# Altium schematic sheet FiveStagePipenlineCPU.SchDoc
size 347 x 254 mm
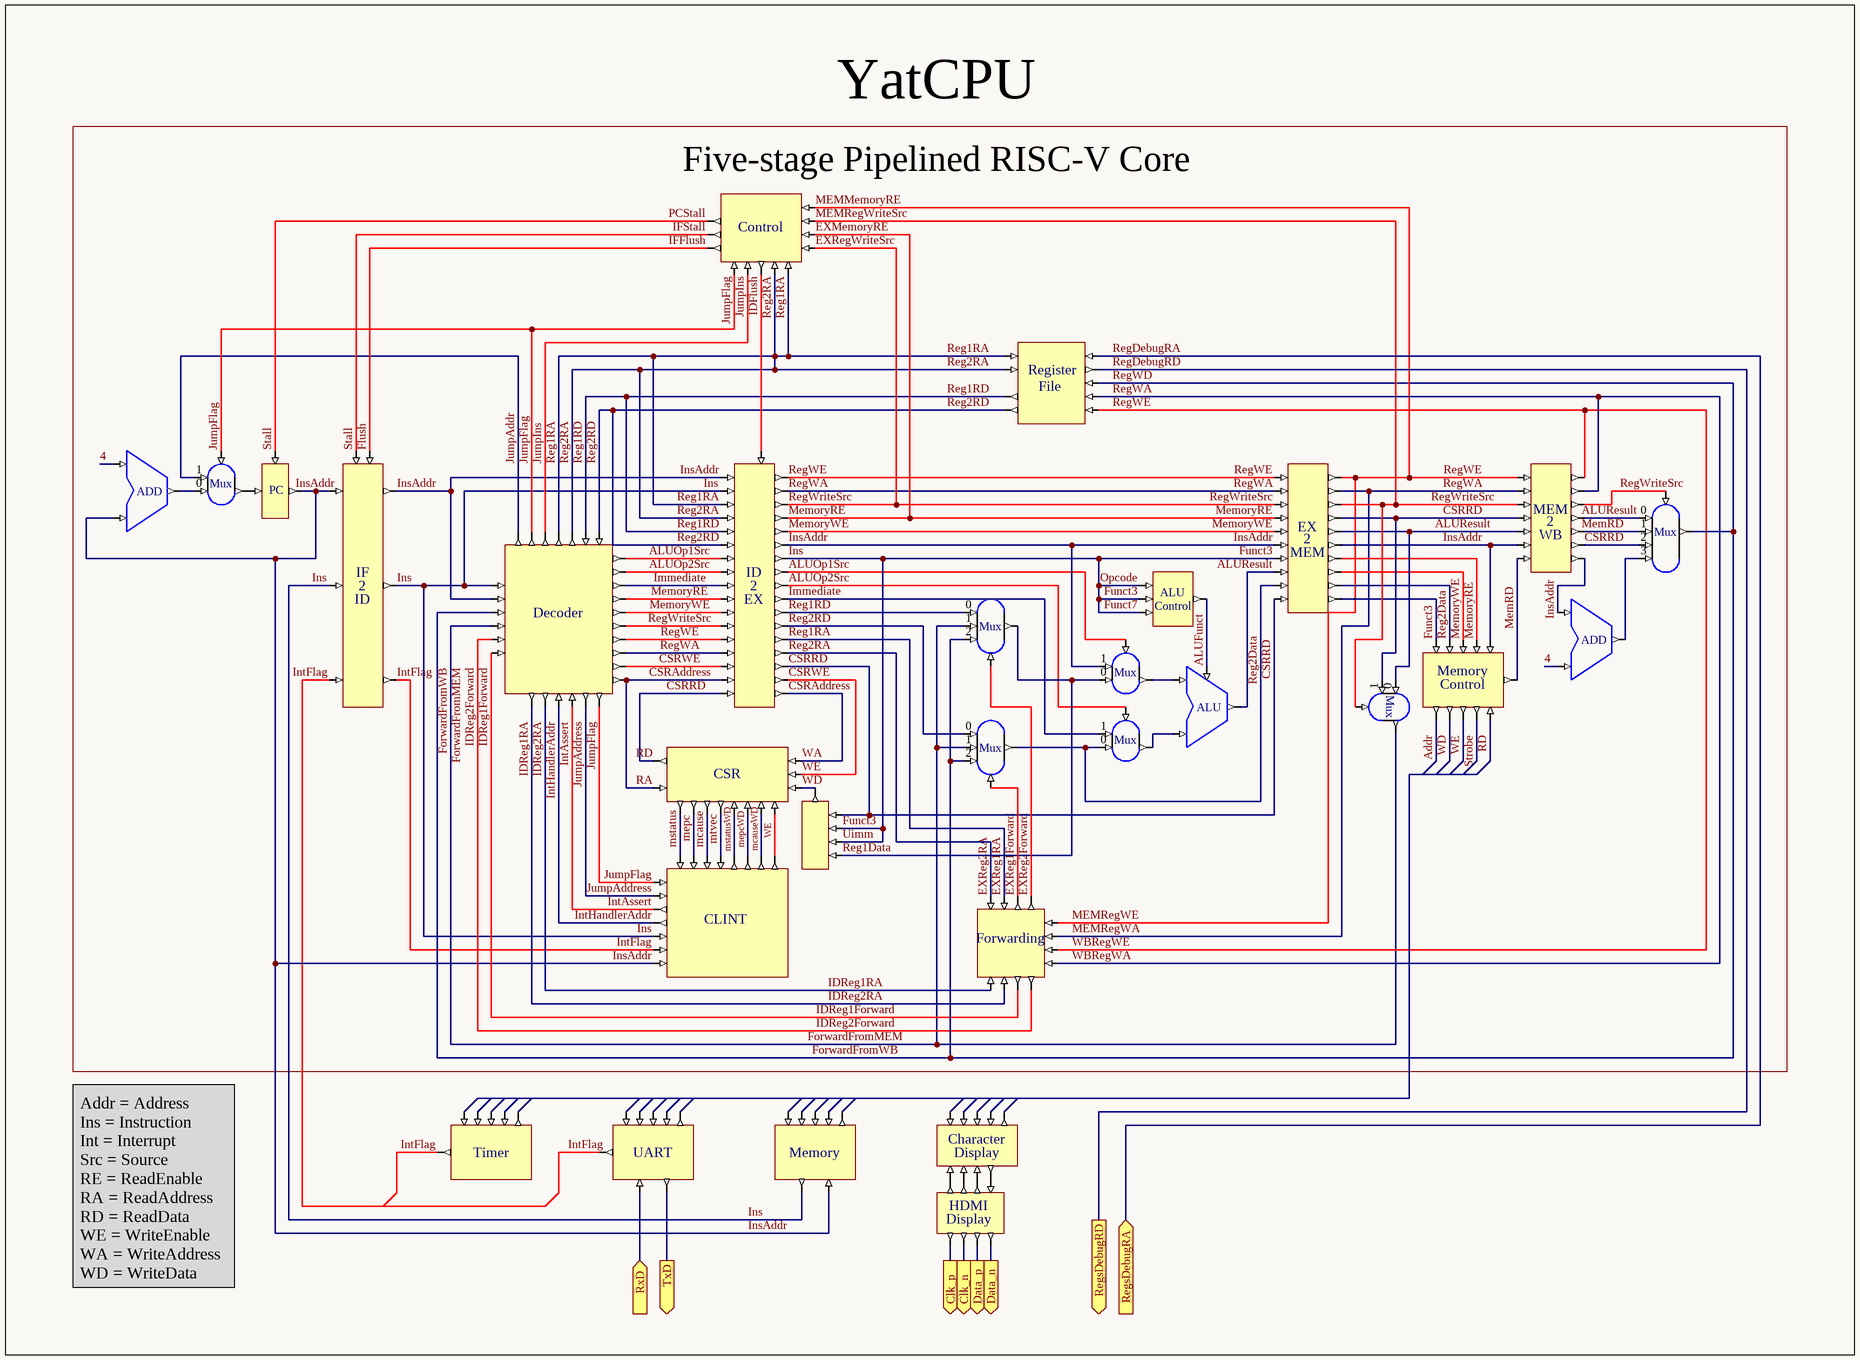
[diagram p0: FiveStagePipenlineCPU.SchDoc]

## Parts
(Parts that share a designator on the sheet are numbered #1, #2 ... from top to bottom, then left to right.)
*#1  Control  (value not drawn)
*#2  PipelineReg16  (value not drawn)
*#3  PC
*#4  PipelineReg7  (value not drawn)
*#5  ID_1  (value not drawn)
*#6  ALUControl  (value not drawn)
*#7  Mux3_1  (value not drawn)
*#8  MemoryControl_1  (value not drawn)
*#9  ALU  (value not drawn)
*#10  Mux2‘  (value not drawn)
*#11  Mux3_1  (value not drawn)
*#12  Mux2  (value not drawn)
*#13  CSRCompute_1  (value not drawn)
*#14  CLINT_1  (value not drawn)
*#15  Forwarding  (value not drawn)
*?#1  RegFile  (value not drawn)
*?#2  ADD  (value not drawn)
*?#3  Mux2  (value not drawn)
*?#4  Mux4  (value not drawn)
*?#5  ADD  (value not drawn)
*?#6  Mux2  (value not drawn)
*?#7  CSR  (value not drawn)
*?#8  Timer  (value not drawn)
*?#9  UART  (value not drawn)
*?#10  Memory  (value not drawn)
*?#11  CharacterDisplay  (value not drawn)
*?#12  HDMIDisplay  (value not drawn)
EX/MEM  PipelineReg10  (value not drawn)
IF/ID  PipelineReg3  (value not drawn)

## Blocks framed on the sheet
YatCPU: *#1-*#15 *?#1-*?#7 EX/MEM IF/ID

## Ports
Clk_n (out), Clk_p (out), Data_n (out), Data_p (out), RegsDebugRA (in), RegsDebugRD (out), RxD (in), TxD (out)

## Nets
4: *?#2.0(in0) *?#5.1(in1)
Addr: *#8.10
ALUFunct: *#6.41 *#9.3
ALUOp1Src: *#2.18 *#2.27 *#5.22 *?#6.3(select)
ALUOp2Src: *#2.7 *#2.28 *#5.14 *#12.3(select)
ALUResult: *#4.15 *#4.26 *#9.2(out) *#10.0(in0) *?#4.0(in0) EX/MEM.3(in) EX/MEM.16
Clk_n: *?#12.47 ; port Clk_n
Clk_p: *?#12.46 ; port Clk_p
CSRAddress: *#2.5(in) *#2.36 *#5.23 *?#7.22 *?#7.28  [also labelled WA]
CSRRD: *#2.6 *#2.38 *#4.17 *#4.25 *#10.1(in1) *#13.37 *?#4.2(in1) *?#7.27 EX/MEM.15 EX/MEM.30
CSRWE: *#2.8 *#2.34 *#5.21 *#8.12 *#14.21 *?#7.23 *?#7.35  [also labelled WE]
Data_n: *?#12.45 ; port Data_n
Data_p: *?#12.48 ; port Data_p
EXMemoryRE: *#1.56 *#2.14 *#2.29 *#5.16 *#8.5 EX/MEM.18 EX/MEM.25  [also labelled MemoryRE]
EXReg1Forward: *#11.4(select) *#15.42
EXReg1RA: *#1.61 *#1.62 *#2.11 *#2.22 *#2.23 *#2.24 *#5.13 *#5.35 *#15.44 *#15.45 *?#1.28 *?#1.29  [also labelled EXReg2RA, Reg1RA, Reg2RA]
EXReg2Forward: *#7.4(select) *#15.43
EXRegWriteSrc: *#1.54 *#1.57 *#2.13 *#2.31 *#4.14 *#4.24 *#5.18 *#10.3(select) *?#4.5(select) EX/MEM.14 EX/MEM.24  [also labelled MEMRegWriteSrc, RegWriteSrc]
Flush: *#1.52 IF/ID.10  [also labelled IFFlush]
ForwardFromMEM: *#5.11 *#5.27 *#7.1(in1) *#7.2(in2) *#10.2(out) *#11.1(in1) *#11.2(in2) *?#1.32 *?#4.4(out)  [also labelled ForwardFromWB, RegWD]
Funct3: *#2.2(in) *#2.17 *#5.25 *#6.38 *#6.39 *#6.40 *#8.8 *#13.36 *#13.38 *#14.25 *?#10.45 EX/MEM.20 EX/MEM.28 IF/ID.3(in) IF/ID.7  [also labelled Funct7, Ins, Opcode, Uimm]
IDFlush: *#1.60 *#2.10(FlushEnable)
IDReg1Forward: *#5.29 *#15.48
IDReg1RA: *#5.39 *#5.40 *#15.46 *#15.47  [also labelled IDReg2RA]
IDReg2Forward: *#5.28 *#15.49
IFStall: *#1.50 *#1.51 *#3.2(EN) IF/ID.9(WriteEnable)  [also labelled PCStall, Stall]
Immediate: *#2.3(in) *#2.19 *#5.15 *#12.1(in1)
InsAddr: *#2.16 *#2.37 *#3.1(OUT) *#4.18 *#4.27 *#5.26 *#8.4 *#14.26 *?#2.1(in1) *?#5.0(in0) *?#6.1(in1) *?#10.46 EX/MEM.17 EX/MEM.27 IF/ID.2(in) IF/ID.6
IntAssert: *#5.32 *#14.23
IntFlag: *#14.28 *?#8.45 IF/ID.8
IntHandlerAddr: *#5.31 *#14.24
JumpAddr: *#5.41 *?#3.1(in0)
JumpAddress: *#5.33 *#14.22
JumpFlag: *#1.58 *#5.34 *#5.38 *#14.27 *?#3.3(select)
JumpIns: *#1.59 *#5.12
mcause: *#14.16 *?#7.30
mcauseWD: *#14.20 *?#7.34
MEMMemoryRE: *#1.53 *#2.32 *#2.35 *#4.2(in) *#4.12 *#5.19 *#15.39 *#15.41 *?#1.34 EX/MEM.2(in) EX/MEM.12  [also labelled MEMRegWE, RegWE, WBRegWE]
MemoryWE: *#2.15 *#2.30 *#5.17 *#8.6 EX/MEM.7 EX/MEM.26
MemRD: *#4.16 *#4.28 *#8.9 *?#4.1(in1)
MEMRegWA: *#2.12 *#2.33 *#4.13 *#4.23 *#5.20 *#15.40 *#15.50 *?#1.33 EX/MEM.13 EX/MEM.23  [also labelled RegWA, WBRegWA]
mepc: *#14.15 *?#7.29
mepcWD: *#14.19 *?#7.33
mstatus: *#14.15 *?#7.29
mstatusWD: *#14.18 *?#7.32
mtvec: *#14.17 *?#7.31
RD: *#8.13
Reg1Data: *#7.3(out) *#13.40 *?#6.0(in0)
Reg1RD: *#2.20 *#2.25 *#5.36 *#7.0(in0) *?#1.30
Reg2Data: *#8.7 *#11.3(out) *#12.0(in0) EX/MEM.19 EX/MEM.29
Reg2RD: *#2.21 *#2.26 *#5.37 *#11.0(in0) *?#1.31
RegDebugRA: *?#1.35 ; port RegsDebugRA
RegDebugRD: *?#1.36 ; port RegsDebugRD
RxD: *?#9.46 ; port RxD
Strobe: *#8.11
TxD: *?#9.47 ; port TxD
WD: *#8.14 *#13.39 *?#7.24
Net*#3_0: *#3.0(IN) *?#3.2(out)
Net*#9_0: *#9.0(in0) *?#6.2(out)
Net*#9_1: *#9.1(in1) *#12.2(out)
Net*?#2_2: *?#2.2(out) *?#3.0(in1)
Net*?#4_3: *?#4.3(in3) *?#5.2(out)
Net*?#11_45: *?#11.45 *?#12.44
Net*?#11_46: *?#11.46 *?#12.43
Net*?#11_47: *?#11.47 *?#12.43
Net*?#11_48: *?#11.48 *?#12.43

Not connected (* = marked no-connect by the designer): *?#8 43 44; *?#9 43 44 45; *?#10 43 44; *?#11 43 44; IF/ID 5(in)

## Buses and harness runs
bus IntFlag

## Notes on the sheet
- (near *#1) Five-stage Pipelined RISC-V Core
- Addr = Address
  Ins = Instruction
  Int = Interrupt
  Src = Source
  RE = ReadEnable
  RA = ReadAddress
  RD = ReadData
  WE = WriteEnable
  WA = WriteAddress
  WD = WriteData
- Labels drawn without touching a wire or pin: ForwardFromMEM, IntFlag, RA, RD
- (in symbol ALUControl) ALU; Control
- (in symbol CharacterDisplay) Character; Display
- (in symbol CLINT_1) CLINT
- (in symbol HDMIDisplay) HDMI; Display
- (in symbol ID_1) Decoder
- (in symbol MemoryControl_1) Memory; Control
- (in symbol Mux2) Mux
- (in symbol Mux2‘) Mux
- (in symbol Mux3_1) Mux
- (in symbol Mux4) Mux
- (in symbol PipelineReg3) IF; ID
- (in symbol PipelineReg7) MEM; WB
- (in symbol PipelineReg10) EX; MEM
- (in symbol PipelineReg16) ID; EX
- (in symbol RegFile) Register; File

## Library data of the parts
*#3 = Reg